# EAGLE design ThingPlus_Micromod-BottomJig (EAGLE 9.6.2)
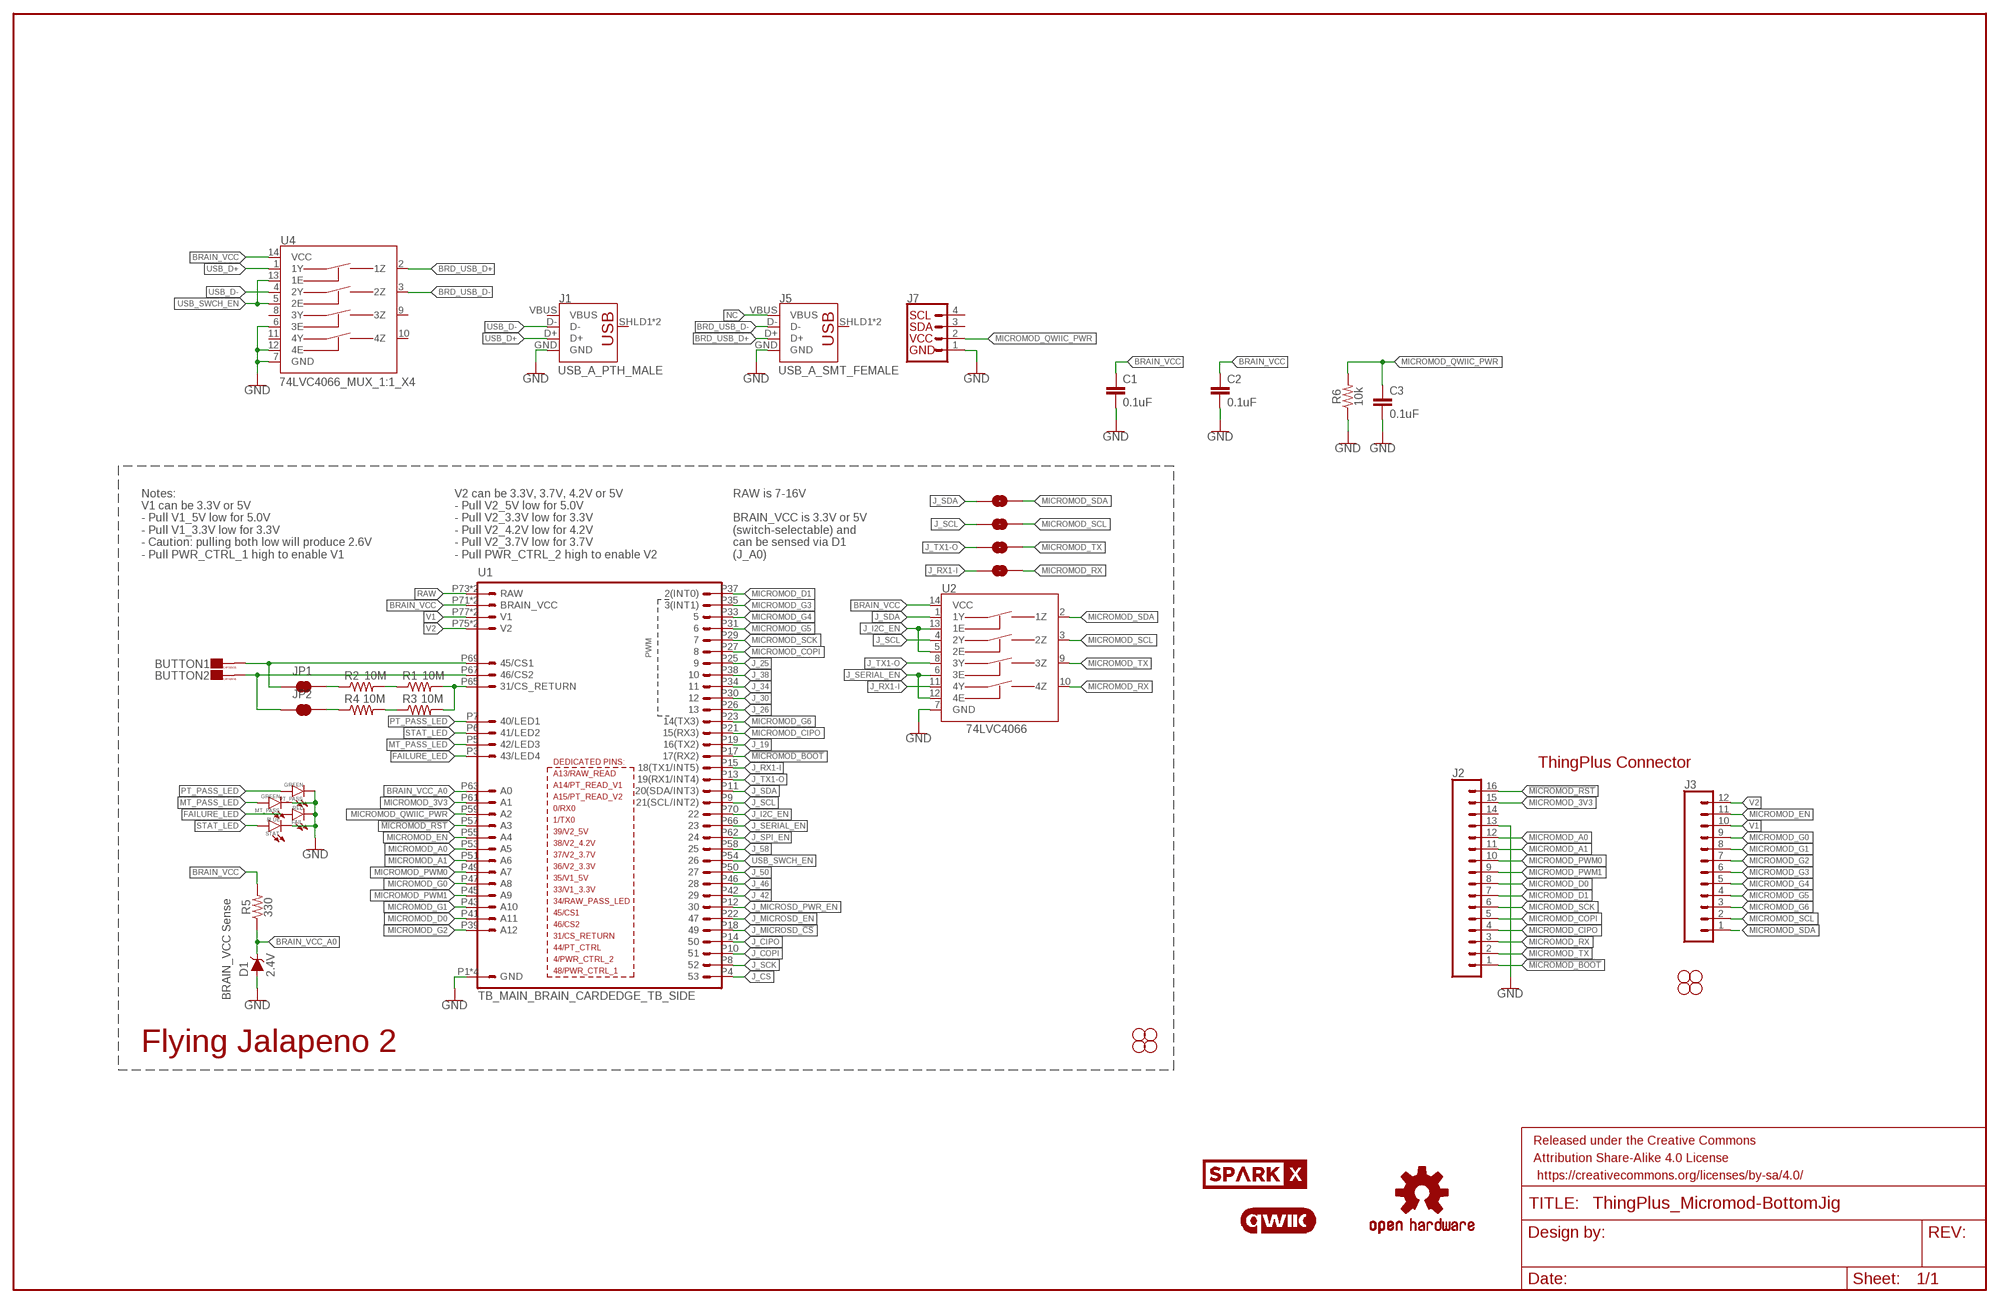
[diagram p0: schematic, sheet 1]

## Parts
BUTTON1  CAPSENSE_BUTTON_PAD_ONLYV2_SMALL  [CAPSENSE_BUTTON_PAD_ONLY_SM]
BUTTON2  CAPSENSE_BUTTON_PAD_ONLYV2_SMALL  [CAPSENSE_BUTTON_PAD_ONLY_SM]
C1  0.1uF  0.1UF-0603-25V-(+80/-20%)  [0603]
C2  0.1uF  0.1UF-0603-25V-(+80/-20%)  [0603]
C3  0.1uF  0.1UF-0603-25V-(+80/-20%)  [0603]
D1  2.4V  DIODE-ZENER-MM3Z2V4T1G  [SOD-323]
FAIL  RED  LED-RED1206  [LED-1206]
FRAME2  FRAME-LEDGER  [CREATIVE_COMMONS]
H1  STAND-OFF  [STAND-OFF]
H2  STAND-OFF  [STAND-OFF]
H3  STAND-OFF  [STAND-OFF]
H4  STAND-OFF  [STAND-OFF]
H5  STAND-OFF  [STAND-OFF]
H6  STAND-OFF  [STAND-OFF]
H7  STAND-OFF  [STAND-OFF]
H8  STAND-OFF  [STAND-OFF]
J1  USB_A_PTH_MALE  [USB-A-H]
J2  CONN_161X16_SM_SQ_NOSILK  [1X16_SM_SQ_NOSILK]
J3  CONN_12SM_SQ_NO_SILK  [1X12_SM_SQ_NOSILK]
J5  USB_A_SMT_FEMALE  [USB-A-S-SILK-FEMALE]
J7  QWIIC_RIGHT_ANGLE  QWIIC_CONNECTORJS-1MM  [JST04_1MM_RA]
J_SCL  JUMPER-SMT_2_NO_SILK  [SMT-JUMPER_2_NO_SILK]
J_SCL1  JUMPER-SMT_2_NO_SILK  [SMT-JUMPER_2_NO_SILK]
J_SCL2  JUMPER-SMT_2_NO_SILK  [SMT-JUMPER_2_NO_SILK]
J_SDA  JUMPER-SMT_2_NO_SILK  [SMT-JUMPER_2_NO_SILK]
JP1  JUMPER-SMT_2_NC_TRACE_SILK  [SMT-JUMPER_2_NC_TRACE_SILK]
JP2  JUMPER-SMT_2_NC_TRACE_SILK  [SMT-JUMPER_2_NC_TRACE_SILK]
LOGO2  OSHW-LOGOMINI  [OSHW-LOGO-MINI]
LOGO4  QWIIC_LOGO_4MM  [QWIIC_4MM]
MT_PASS  GREEN  LED-GREEN1206  [LED-1206]
PT_PASS  GREEN  LED-GREEN1206  [LED-1206]
R1  10M  10MOHM-0603-1/10W-5%  [0603]
R2  10M  10MOHM-0603-1/10W-5%  [0603]
R3  10M  10MOHM-0603-1/10W-5%  [0603]
R4  10M  10MOHM-0603-1/10W-5%  [0603]
R5  330  330OHM-0603-1/10W-1%  [0603]
R6  10k  10KOHM-0603-1/10W-1%  [0603]
STAT  BLUE  LED-BLUE1206  [LED-1206]
U1  TB_MAIN_BRAIN_CARDEDGE_TB_SIDE  [TB_CARDEDGE]
U2  74LVC4066  74LVC4066D_QUAD_BILATERAL_SWITCH  [SO14]
U4  74LVC4066_MUX_1:1_X4  [SO14]
U$1  SPARKX-LOGO4  [SPARKX-MEDIUM]

## Nets
!MICROMOD_BOOT!: J2.1 U1.P17(17(RX2))
!MICROMOD_RST!: J2.16 U1.P57(A3)
BRAIN_VCC: C1.1 C2.1 R5.2 U1.P71(BRAIN_VCC) U1.P72(BRAIN_VCC) U2.14(VCC) U4.14(VCC)
BRAIN_VCC_A0: D1.C R5.1 U1.P63(A0)
BRD_USB_D+: J5.D+ U4.2(1Z)
BRD_USB_D-: J5.D- U4.3(2Z)
FAILURE_LED: FAIL.A U1.P3(43/LED4)
GND: C1.2 C2.2 C3.2 D1.A FAIL.C J1.GND J2.13 J5.GND J7.1 MT_PASS.C PT_PASS.C R6.1 STAT.C U1.P1(GND) U1.P2(GND) U1.P79(GND) U1.P80(GND) U2.7(GND) U4.6(3E) U4.7(GND) U4.12(4E)
J_19: U1.P19(16(TX2))
J_25: U1.P25
J_26: U1.P26
J_30: U1.P30
J_34: U1.P34
J_38: U1.P38
J_42: U1.P42
J_46: U1.P46
J_50: U1.P50
J_58: U1.P58
J_CIPO: U1.P14
J_COPI: U1.P10
J_CS: U1.P4
J_I2C_EN: U1.P70 U2.5(2E) U2.13(1E)
J_MICROSD_!CS!: U1.P18
J_MICROSD_EN: U1.P22
J_MICROSD_PWR_EN: U1.P12
J_RX1-I: J_SDA.1 U1.P15(18(TX1/INT5)) U2.11(4Y)
J_SCK: U1.P8
J_SCL: J_SCL.1 U1.P9(21(SCL/INT2)) U2.4(2Y)
J_SDA: J_SCL2.1 U1.P11(20(SDA/INT3)) U2.1(1Y)
J_SERIAL_EN: U1.P66 U2.6(3E) U2.12(4E)
J_SPI_EN: U1.P62
J_TX1-O: J_SCL1.1 U1.P13(19(RX1/INT4)) U2.8(3Y)
MICROMOD_3V3: J2.15 U1.P61(A1)
MICROMOD_A0: J2.12 U1.P53(A5)
MICROMOD_A1: J2.11 U1.P51(A6)
MICROMOD_CIPO: J2.4 U1.P21(15(RX3))
MICROMOD_COPI: J2.5 U1.P27
MICROMOD_D0: J2.8 U1.P41(A11)
MICROMOD_D1: J2.7 U1.P37(2(INT0))
MICROMOD_EN: J3.11 U1.P55(A4)
MICROMOD_G0: J3.9 U1.P47(A8)
MICROMOD_G1: J3.8 U1.P43(A10)
MICROMOD_G2: J3.7 U1.P39(A12)
MICROMOD_G3: J3.6 U1.P35(3(INT1))
MICROMOD_G4: J3.5 U1.P33
MICROMOD_G5: J3.4 U1.P31
MICROMOD_G6: J3.3 U1.P23(14(TX3))
MICROMOD_PWM0: J2.10 U1.P49(A7)
MICROMOD_PWM1: J2.9 U1.P45(A9)
MICROMOD_QWIIC_PWR: C3.1 J7.2 R6.2 U1.P59(A2)
MICROMOD_RX: J2.3 J_SDA.2 U2.10(4Z)
MICROMOD_SCK: J2.6 U1.P29
MICROMOD_SCL: J3.2 J_SCL.2 U2.3(2Z)
MICROMOD_SDA: J3.1 J_SCL2.2 U2.2(1Z)
MICROMOD_TX: J2.2 J_SCL1.2 U2.9(3Z)
MT_PASS_LED: MT_PASS.A U1.P5(42/LED3)
N$1 [CAPSENSE]: R1.2 R3.2 U1.P65(31/CS_RETURN)
N$7 [CAPSENSE]: R1.1 R2.2
N$15: BUTTON1.CAPSENSE_PAD(CAPSENSE) JP1.1 U1.P69(45/CS1)
N$16 [CAPSENSE]: R3.1 R4.2
N$17 [CAPSENSE]: JP2.2 R4.1
N$18: BUTTON2.CAPSENSE_PAD(CAPSENSE) JP2.1 U1.P67(46/CS2)
N$19 [CAPSENSE]: JP1.2 R2.1
NC: J5.VBUS
PT_PASS_LED: PT_PASS.A U1.P7(40/LED1)
RAW: U1.P73(RAW) U1.P74(RAW)
STAT_LED: STAT.A U1.P6(41/LED2)
USB_D+: J1.D+ U4.1(1Y)
USB_D-: J1.D- U4.4(2Y)
USB_SWCH_EN: U1.P54 U4.5(2E) U4.13(1E)
V1 [15_mil]: J3.10 U1.P77(V1) U1.P78(V1)
V2: J3.12 U1.P75(V2) U1.P76(V2)
Unconnected: J1.SHLD1(SHIELD) J1.SHLD2(SHIELD) J2.14 J5.SHLD1(SHIELD) J5.SHLD2(SHIELD) J7.3 J7.4 U4.8(3Y) U4.9(3Z) U4.10(4Z) U4.11(4Y)

## Notes on the sheet
- Notes:
  V1 can be 3.3V or 5V
  - Pull V1_5V low for 5.0V
  - Pull V1_3.3V low for 3.3V
  - Caution: pulling both low will produce 2.6V
  - Pull PWR_CTRL_1 high to enable V1
- V2 can be 3.3V, 3.7V, 4.2V or 5V
  - Pull V2_5V low for 5.0V
  - Pull V2_3.3V low for 3.3V
  - Pull V2_4.2V low for 4.2V
  - Pull V2_3.7V low for 3.7V
  - Pull PWR_CTRL_2 high to enable V2
- RAW is 7-16V
  
  BRAIN_VCC is 3.3V or 5V
  (switch-selectable) and
  can be sensed via D1
  (J_A0)
- ThingPlus Connector
- BRAIN_VCC Sense
- Flying Jalapeno 2

## Power pins joined to a net without a drawn wire
VBUS: J1.VBUS

## Library data of the parts
BUTTON1 BUTTON2 = Testing:CAPSENSE_BUTTON_PAD_ONLY
C1-C3 = SparkFun-Capacitors:0.1UF: 0.1µF ceramic capacitors A capacitor is a passive two-terminal electrical component used to store electrical energy temporarily in an electric field.; PROD_ID: CAP-00810
D1 = New-Parts_SparkFun-DiscreteSemi:DIODE-ZENER: Zener Diode A Zener diode allows current to flow from its anode to its cathode like a normal semiconductor diode, but it also permits current to flow in the reverse direction when its "Zener voltage" is reached. - WIkipedia; DIGIKEY_PART: MM3Z2V4T1GOSCT-ND
FAIL = SparkFun-LED:LED-RED: Red SMD LED Used in manufacturing of most products at SparkFun Packages: 0603 - SMD 0603 package [Product Link] <http://docs.avagotech.com/docs/AV02-0551EN> 0603 SMART - SMD 0603 SMART package ( more efficient and expensive)[Product Link] <http://www.osram-os.com/Graphics/XPic2/00077099_0.pdf> 1206 - SMD1206 package [Product Link] <https://www.sparkfun.com/datasheets/DevTools/LilyPad/Q150OVS4.pdff> SparkFun Products: Pro Mini 328 -5V <https://www.sparkfun.com/products/821> RedBoard <https://www.sparkfun.com/products/12757> IOIO-OTG <https://www.sparkfun.com/products/13613>; PROD_ID: DIO-09912
FRAME2 = SparkFun-Aesthetics:FRAME-LEDGER: Schematic Frame - Ledger Standard 11x14 US Ledger frame
H1-H8 = SparkFun-Hardware:STAND-OFF: Stand Off Drill holes for mechanically mounting via screws, standoffs, etc. Note: Use the keepout ring to avoid running the screw head into surrounding components. Variant Overviews STAND-OFF - Mechanical footprint for a #4 phillips button head screw. STAND-OFF-TIGHT - Mechanical footprint for a #4 phillips button head screw, Example SparkFun Products Screw - Phillips Head (1/4", 4-40, 10 pack) <https://www.sparkfun.com/products/10453> (PRT-10453) Screw - Phillips Head (1/2", 4-40, 10 pack) <https://www.sparkfun.com/products/10452> (PRT-10452) Screw - Phillips Head (3/4", 4-40, 10 pack) <https://www.sparkfun.com/products/10451> (PRT-10451) Screw - Phillips Head (1", 4-40, 10 pack) <https://www.sparkfun.com/products/10450> (PRT-10450)
J1 = SparkFun-Connectors:USB_A: USB-A Connector Male and female variants, as well as PTH and SMT variants SparkFun Products: SparkFun XBee Explorer Dongle <https://www.sparkfun.com/products/11697> PTH Male SparkFun MicroView-USB Programmer <https://www.sparkfun.com/products/12924> SMT Male SparkFun USB Type A Female Breakout <https://www.sparkfun.com/products/12700> SMT Female; PROD_ID: CONN-08367; SF_ID: PRT-00437
J2 = SparkFun-Connectors:CONN_16: Multi connection point. Often used as Generic Header-pin footprint for 0.1 inch spaced/style header connections On any of the 0.1 inch spaced packages, you can populate with these: Break Away Headers - Straight <https://www.sparkfun.com/products/116> (PRT-00116) Break Away Male Headers - Right Angle <https://www.sparkfun.com/products/553> (PRT-00553) Female Headers <https://www.sparkfun.com/products/115> (PRT-00115) Break Away Headers - Machine Pin <https://www.sparkfun.com/products/117> (PRT-00117) Break Away Female Headers - Swiss Machine Pin <https://www.sparkfun.com/products/743> (PRT-00743) For SCREWTERMINALS and SPRING TERMINALS visit here: Screw Terimnals on SparkFun.com <https://www.sparkfun.com/search/results?term=Screw+Terminals> (5mm/3.5mm/2.54mm spacing) This device is also useful as a general connection point to wire up your design to another part of your project. Our various solder wires solder well into these plated through hole pads. Hook-Up Wire - Assortment (Stranded, 22 AWG) <https://www.sparkfun.com/products/11375> (PRT-11375) Hook-Up Wire - Assortment (Solid Core, 22 AWG) <https://www.sparkfun.com/products/11367> (PRT-11367) View the entire wire category on our website here <https://www.sparkfun.com/categories/141> Special notes: Molex polarized connector foot print use with SKU : PRT-08231 with associated crimp pins and housings. 1MM SMD Version SKU: PRT-10208 NOTES ON THE VARIANTS LOCK and LOCK_LONGPADS... This footprint was designed to help hold the alignment of a through-hole component (i.e. 6-pin header) while soldering it into place. You may notice that each hole has been shifted either up or down by 0.005 of an inch from it's more standard position (which is a perfectly straight line). This slight alteration caused the pins (the squares in the middle) to touch the edges of the holes. Because they are alternating, it causes a "brace" to hold the component in place. 0.005 has proven to be the perfect amount of "off-center" position when using our standard breakaway headers. Although looks a little odd when you look at the bare footprint, once you have a header in there, the alteration is very hard to notice. Also,if you push a header all the way into place, it is covered up entirely on the bottom side.
J3 = SparkFun-Connectors:CONN_12: Multi connection point. Often used as Generic Header-pin footprint for 0.1 inch spaced/style header connections On any of the 0.1 inch spaced packages, you can populate with these: Break Away Headers - Straight <https://www.sparkfun.com/products/116> (PRT-00116) Break Away Male Headers - Right Angle <https://www.sparkfun.com/products/553> (PRT-00553) Female Headers <https://www.sparkfun.com/products/115> (PRT-00115) Break Away Headers - Machine Pin <https://www.sparkfun.com/products/117> (PRT-00117) Break Away Female Headers - Swiss Machine Pin <https://www.sparkfun.com/products/743> (PRT-00743) For SCREWTERMINALS and SPRING TERMINALS visit here: Screw Terimnals on SparkFun.com <https://www.sparkfun.com/search/results?term=Screw+Terminals> (5mm/3.5mm/2.54mm spacing) This device is also useful as a general connection point to wire up your design to another part of your project. Our various solder wires solder well into these plated through hole pads. Hook-Up Wire - Assortment (Stranded, 22 AWG) <https://www.sparkfun.com/products/11375> (PRT-11375) Hook-Up Wire - Assortment (Solid Core, 22 AWG) <https://www.sparkfun.com/products/11367> (PRT-11367) View the entire wire category on our website here <https://www.sparkfun.com/categories/141> Special notes: Molex polarized connector foot print use with SKU : PRT-08231 with associated crimp pins and housings. 1MM SMD Version SKU: PRT-10208 NOTES ON THE VARIANTS LOCK and LOCK_LONGPADS... This footprint was designed to help hold the alignment of a through-hole component (i.e. 6-pin header) while soldering it into place. You may notice that each hole has been shifted either up or down by 0.005 of an inch from it's more standard position (which is a perfectly straight line). This slight alteration caused the pins (the squares in the middle) to touch the edges of the holes. Because they are alternating, it causes a "brace" to hold the component in place. 0.005 has proven to be the perfect amount of "off-center" position when using our standard breakaway headers. Although looks a little odd when you look at the bare footprint, once you have a header in there, the alteration is very hard to notice. Also,if you push a header all the way into place, it is covered up entirely on the bottom side.
J5 = SparkFun-Connectors:USB_A: USB-A Connector Male and female variants, as well as PTH and SMT variants SparkFun Products: SparkFun XBee Explorer Dongle <https://www.sparkfun.com/products/11697> PTH Male SparkFun MicroView-USB Programmer <https://www.sparkfun.com/products/12924> SMT Male SparkFun USB Type A Female Breakout <https://www.sparkfun.com/products/12700> SMT Female; PROD_ID: CONN-09520; SF_ID: PRT-09011
J7 = SparkFun-Connectors:QWIIC_CONNECTOR: SparkFun I2C Standard Qwiic Connector An SMD 1mm pitch JST connector makes it easy and quick (get it? Qwiic?) to connect I2C devices to each other. The Qwiic system <http://www.sparkfun.com/qwiic> enables fast and solderless connection between popular platforms and various sensors and actuators. We carry 200mm <https://www.sparkfun.com/products/14204>, 100mm <https://www.sparkfun.com/products/14205>, 50mm <https://www.sparkfun.com/products/14206>, and breadboard friendly <https://www.sparkfun.com/products/14207> Qwiic cables. We also offer 10 pcs strips <https://www.sparkfun.com/products/14323> the SMD connectors.; PROD_ID: CONN-13694
J_SCL J_SCL1 J_SCL2 J_SDA = SparkFun-Jumpers:JUMPER-SMT_2_NO: Normally open jumper This jumper has two pads in close proximity to each other. Apply solder to close the connection. Round pads are easier to solder for beginners, but are a lot larger. SparkFun Product that uses the round pads: SparkFun EL Sequencer <https://www.sparkfun.com/products/12781>
JP1 JP2 = SparkFun-Jumpers:JUMPER-SMT_2_NC_TRACE: Normally closed trace jumper This jumper has a trace between two pads so it's normally closed (NC). Use a razor knife to open the connection. For best results follow the IPC guidelines for cutting traces: Cutout at least 0.063 mm (0.005 in). Remove all loose material to clean up the cut area. Seal the cut with an approved epoxy. Reapply solder to reclose the connection.
LOGO2 = SparkFun-Aesthetics:OSHW-LOGO: Open-Source Hardware (OSHW) Logo This logo indicates the piece of hardware it is found on incorporates a OSHW license and/or adheres to the definition of open source hardware found here: http://freedomdefined.org/OSHW
LOGO4 = SparkFun-Aesthetics:QWIIC_LOGO: Qwiic Logos for placement on schematic and PCB. The 5.5mm silk logo is best for placing next to Qwiic connector.
MT_PASS PT_PASS = SparkFun-LED:LED-GREEN: Green SMD LED Used in manufacturing of various products at SparkFun Packages: 0603 - SMD 0603 package [Product Link] <http://www.futureelectronics.com/en/technologies/semiconductors/optoelectronics/leds/Pages/9894312-LTST-C190GKT.aspx?CrossPart=HSMG-C190&IM=0> LilyPad 1206 - SMD1206 LilyPad package [Product Link] <http://www.futureelectronics.com/en/Technologies/Product.aspx?ProductID=IN150NGHARVATEKCORPORATION2049943&IM=0> 1206 - SMD1206 package [Product Link] <http://www.futureelectronics.com/en/technologies/semiconductors/optoelectronics/leds/Pages/8315665-LTST-C150KGKT.aspx?IM=0> 1206 Bottom Mount -SMD 1206 Bottom Mount [Product Link] <http://www.digikey.com/product-detail/en/lite-on-inc/LTST-C230KGKT/160-1456-1-ND/386854> SparkFun Products: Pro Mini 328 -5V <https://www.sparkfun.com/products/821> RedBoard <https://www.sparkfun.com/products/12757> MP3 Trigger <https://www.sparkfun.com/products/13720> Makey Makey <https://www.sparkfun.com/products/11076>; PROD_ID: DIO-00862
R1-R4 = SparkFun-Resistors:10MOHM: RES-09327; PROD_ID: RES-08283
R5 = SparkFun-Resistors:330OHM: 330Ω resistor A resistor is a passive two-terminal electrical component that implements electrical resistance as a circuit element. Resistors act to reduce current flow, and, at the same time, act to lower voltage levels within circuits. - Wikipedia; PROD_ID: RES-00818
R6 = SparkFun-Resistors:10KOHM: 10kΩ resistor A resistor is a passive two-terminal electrical component that implements electrical resistance as a circuit element. Resistors act to reduce current flow, and, at the same time, act to lower voltage levels within circuits. - Wikipedia; PROD_ID: RES-00824
STAT = SparkFun-LED:LED-BLUE: Blue SMD LED Used in manufacturing of various products at SparkFun Packages: 0603 - SMD 0603 package [Product Link] <http://www.digikey.com/product-detail/en/SMLE12BC7TT86/511-1589-2-ND/1641808> 1206 - SMD1206 package [Product Link] <http://www.digikey.com/product-detail/en/lite-on-inc/LTST-C150TBKT/160-1643-1-ND/573584> SparkFun Products: ESP8266 Thing-Dev Board <https://www.sparkfun.com/products/13711> RedBoard <https://www.sparkfun.com/products/12757>; PROD_ID: DIO-09911
U1 = Testing:TB_MAIN_BRAIN_CARDEDGE
U2 = SparkFun-IC-Logic:74LVC4066D_QUAD_BILATERAL_SWITCH: Nexperia Quad Bilateral Switch The 74LVC4066 is a high-speed Si-gate CMOS device. The 74LVC4066 provides four single pole, single-throw analog switch functions. Each switch has two input/output terminals (nY and nZ) and an active HIGH enable input (nE). When nE is LOW, the analog switch is turned off. Schmitt-trigger action at the enable inputs makes the circuit tolerant of slower input rise and fall times across the entire VCC range from 1.65 V to 5.5 V. Datasheet <https://assets.nexperia.com/documents/data-sheet/74LVC4066.pdf>; PROD_ID: IC-13944
U4 = Testing:74LVC4066_MUX_1:1_X4
U$1 = SparkX:SPARKX-LOGO

## Net classes
1 power: width 0.457 mm
2 12 mil: width 0.305 mm
3 CAPSENSE: width 0.508 mm
4 15_mil: width 0.381 mm

## Board
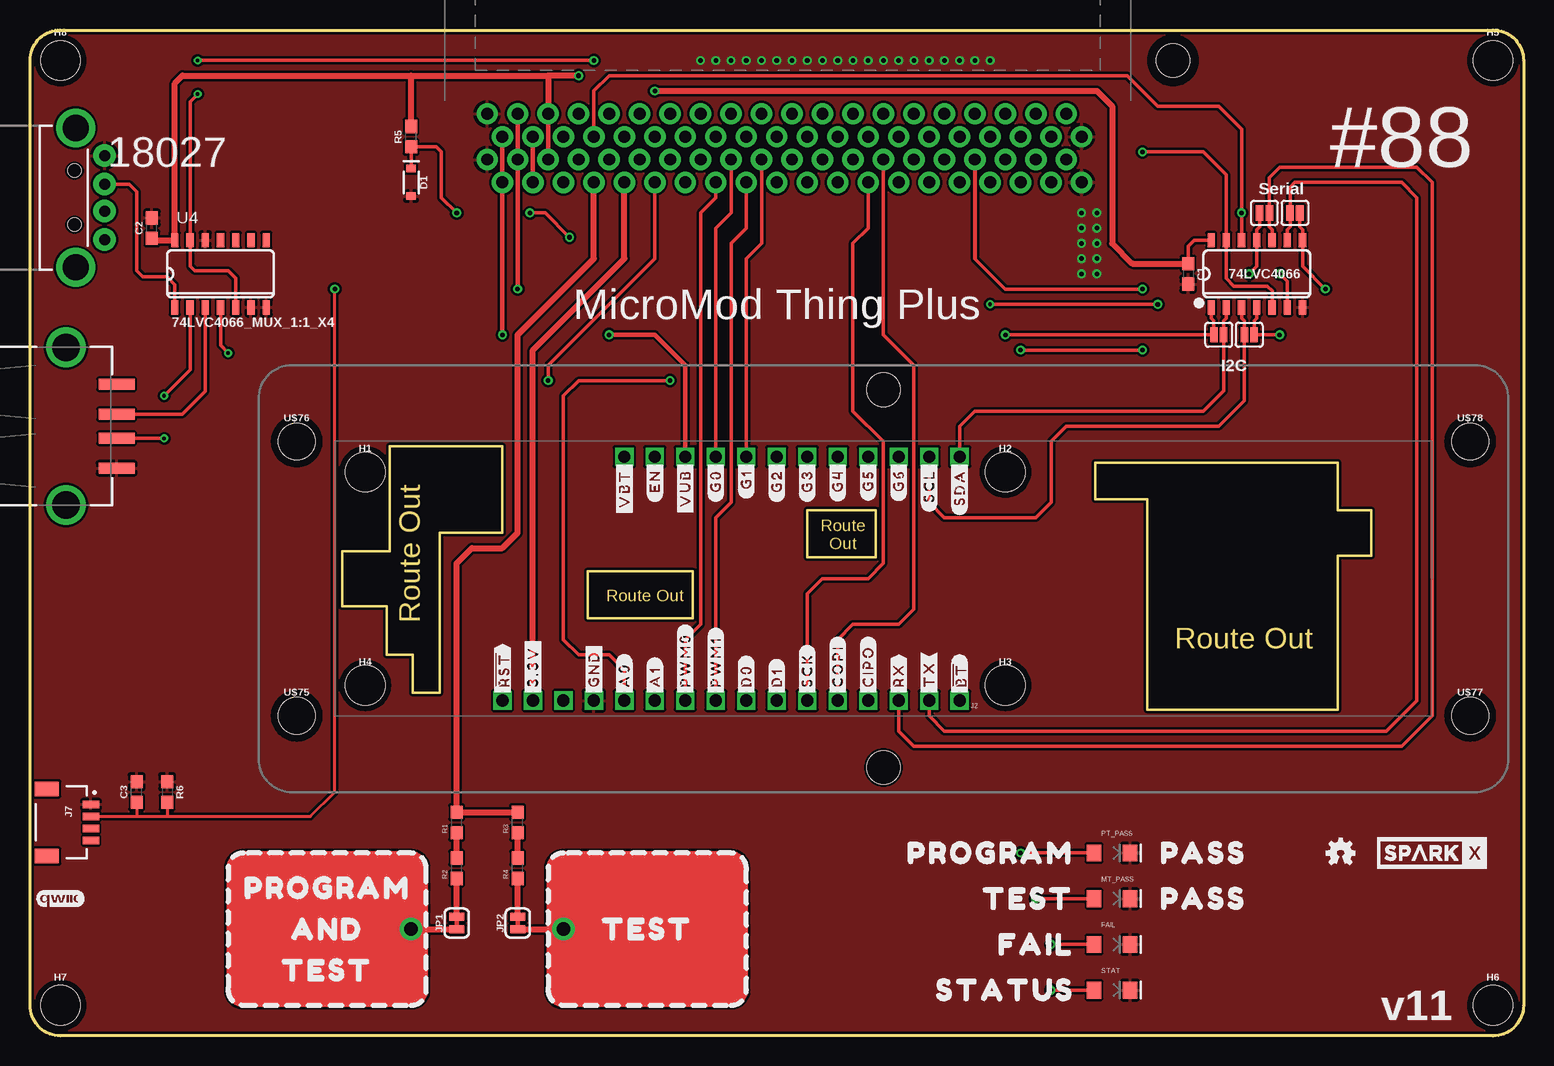
[diagram p1: board, top side]
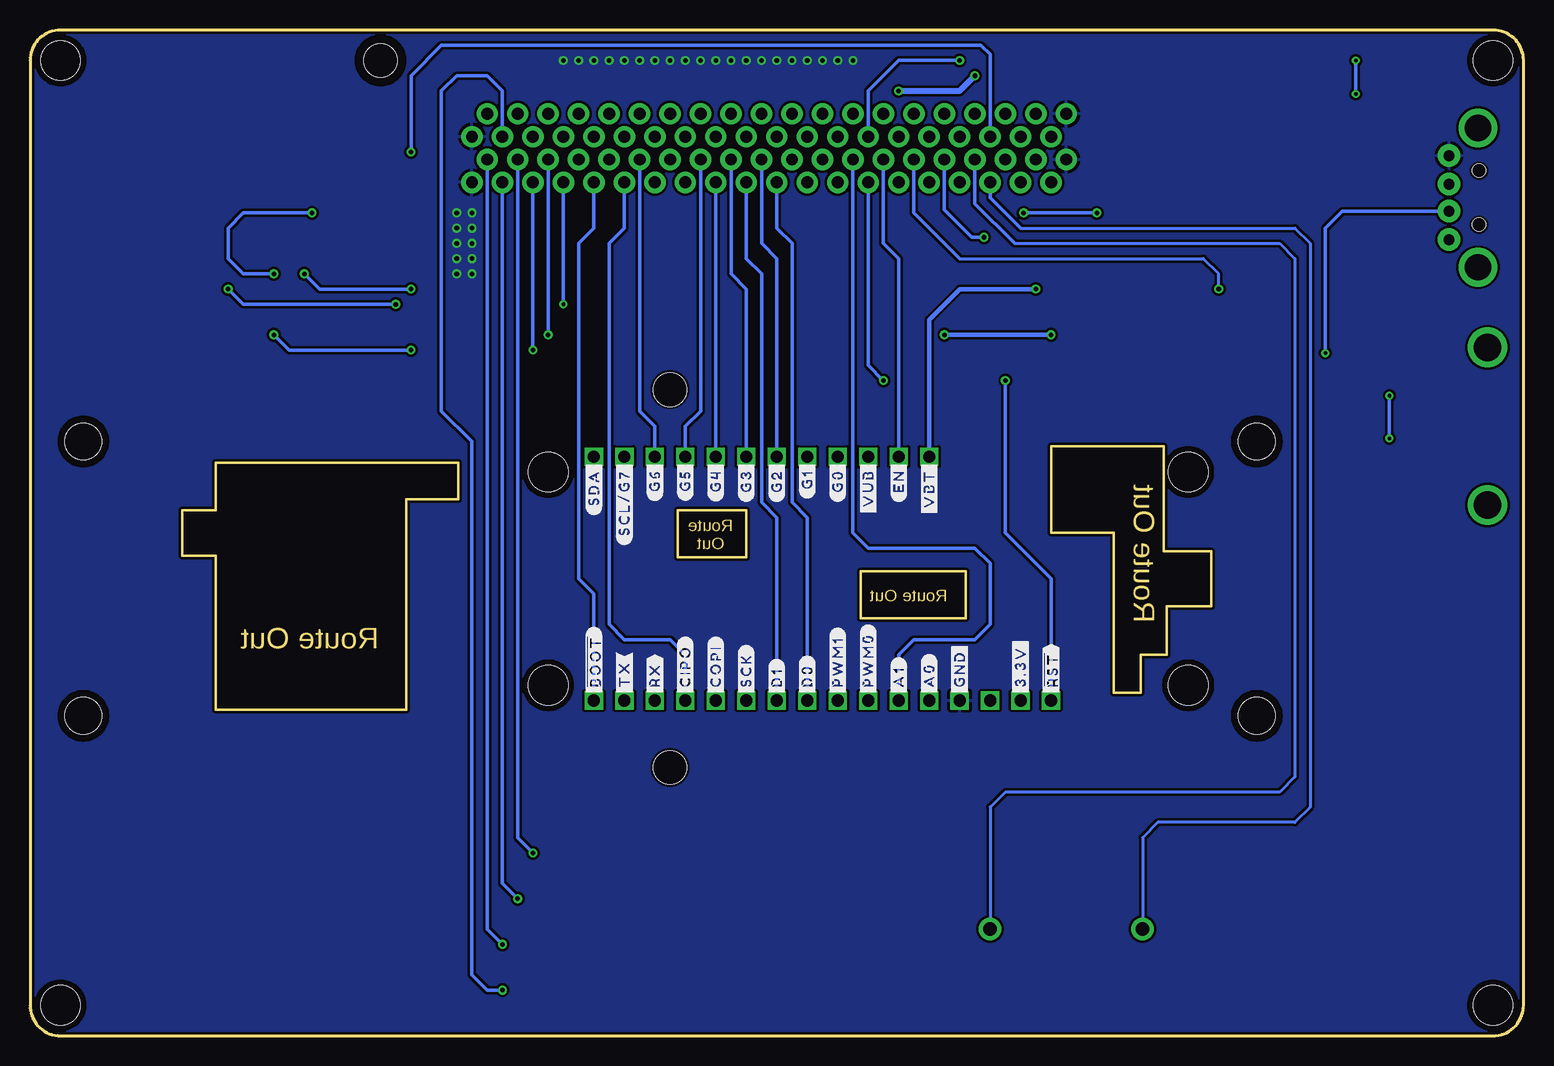
[diagram p2: board, bottom side, seen from below]

Size 124.46 x 83.82 mm. Coordinates in mm from the lower left corner, seen from the top.
Outline: 2.54,83.82 121.92,83.82 arc-90 124.46,81.28 124.46,2.54 arc-90 121.92,0 2.54,0 arc-90 0,2.54 0,81.28 arc-90 2.54,83.82
Outline: 31.88,28.57 34.16,28.57 34.16,41.91 39.37,41.91 39.37,49.15 29.97,49.15 29.97,40.39 26.03,40.39 26.03,35.81 29.72,35.81 29.72,31.75 31.88,31.75 31.88,28.57
Outline: 46.48,38.73 55.25,38.73 55.25,34.8 46.48,34.8 46.48,38.73
Outline: 64.77,43.81 70.48,43.81 70.48,39.88 64.77,39.88 64.77,43.81
Outline: 88.77,47.75 108.97,47.75 108.97,43.81 111.76,43.81 111.76,40 108.97,40 108.97,27.18 93.09,27.18 93.09,44.7 88.77,44.7 88.77,47.75
Copper layers (1*16): Top 0.035mm / dielectric 1.5mm / Bottom 0.035mm
Design rules "SparkFun-2-Layer-General-JLCPCB": minimum track width 7mil, minimum drill 0.3mm, track to track 7mil, track to pad 7mil, pad to pad 7mil, via to via 7mil, smd to smd 7mil, copper to edge 7mil, drill to drill 7mil, minimum pad ring 7mil, minimum via ring 7mil, stop-mask expansion 4mil, vias tented up to drill 25mil, thermal gap 10mil
Milling: area 26,28.6 to 39.4,49.1; area 46.5,34.8 to 55.2,38.7; area 64.8,39.9 to 70.5,43.8; area 88.8,27.2 to 111.8,47.8

### Footprints (pad centres in the part's own frame; a part is rotated, then mirrored left to right if it is on the bottom)
CAPSENSE_BUTTON_PAD_ONLY_SM = drill 1.118 pad 1.88: CAPSENSE_PAD 0,6.35
0603 = smd 1.1 x 1: 1 -0.85,0; 2 0.85,0
SOD-323 = smd 0.63 x 0.83: A 1.15,0; C -1.15,0
LED-1206 = smd 1.2 x 1.4: A -1.5,0; C 1.5,0
STAND-OFF = hole 3.302: 0,0
USB-A-H = drill 0.914 pad 1.88: D+ 2.4,1.127; D- 2.4,-1.127; GND 2.4,3.5; VBUS 2.4,-3.5 | drill 2.2: SHLD1 0,-5.8; SHLD2 0,5.8 | hole 1.1: -0.1,2.25; -0.1,-2.25
1X16_SM_SQ_NOSILK = drill 1.016 pad 1.27 square: 1 0,0; 2 2.54,0; 3 5.08,0; 4 7.62,0; 5 10.16,0; 6 12.7,0; 7 15.24,0; 8 17.78,0; 9 20.32,0; 10 22.86,0; 11 25.4,0; 12 27.94,0; 13 30.48,0; 14 33.02,0; 15 35.56,0; 16 38.1,0
1X12_SM_SQ_NOSILK = drill 1.016 pad 1.27 square: 1 0,0; 2 2.54,0; 3 5.08,0; 4 7.62,0; 5 10.16,0; 6 12.7,0; 7 15.24,0; 8 17.78,0; 9 20.32,0; 10 22.86,0; 11 25.4,0; 12 27.94,0
USB-A-S-SILK-FEMALE = smd 3 x 0.9: D+ 7.212,-1; D- 7.212,1; GND 7.212,-3.5; VBUS 7.212,3.5 | drill 2.311: SHLD1 3,-6.566; SHLD2 3,6.566
JST04_1MM_RA = smd 0.6 x 1.35: 1 -1.5,0; 2 -0.5,0; 3 0.5,0; 4 1.5,0 | smd 1.2 x 2: NC1 2.8,-3.675; NC2 -2.8,-3.675
SMT-JUMPER_2_NO_SILK = smd 0.635 x 1.27: 1 -0.406,0; 2 0.406,0
SMT-JUMPER_2_NC_TRACE_SILK = smd 0.66 x 1.27: 1 -0.521,0; 2 0.521,0
TB_CARDEDGE = drill 0.991 pad 1.778: P1 24.13,-7.62; P2 24.13,-3.81; P3 22.86,-5.715; P4 22.86,-1.905; P5 21.59,-7.62; P6 21.59,-3.81; P7 20.32,-5.715; P8 20.32,-1.905; P9 19.05,-7.62; P10 19.05,-3.81; P11 17.78,-5.715; P12 17.78,-1.905; P13 16.51,-7.62; P14 16.51,-3.81; P15 15.24,-5.715; P16 15.24,-1.905; P17 13.97,-7.62; P18 13.97,-3.81; P19 12.7,-5.715; P20 12.7,-1.905; P21 11.43,-7.62; P22 11.43,-3.81; P23 10.16,-5.715; P24 10.16,-1.905; P25 8.89,-7.62; P26 8.89,-3.81; P27 7.62,-5.715; P28 7.62,-1.905; P29 6.35,-7.62; P30 6.35,-3.81; P31 5.08,-5.715; P32 5.08,-1.905; P33 3.81,-7.62; P34 3.81,-3.81; P35 2.54,-5.715; P36 2.54,-1.905; P37 1.27,-7.62; P38 1.27,-3.81; P39 0,-5.715; P40 0,-1.905; P41 -1.27,-7.62; P42 -1.27,-3.81; P43 -2.54,-5.715; P44 -2.54,-1.905; P45 -3.81,-7.62; P46 -3.81,-3.81; P47 -5.08,-5.715; P48 -5.08,-1.905; P49 -6.35,-7.62; P50 -6.35,-3.81; P51 -7.62,-5.715; P52 -7.62,-1.905; P53 -8.89,-7.62; P54 -8.89,-3.81; P55 -10.16,-5.715; P56 -10.16,-1.905; P57 -11.43,-7.62; P58 -11.43,-3.81; P59 -12.7,-5.715; P60 -12.7,-1.905; P61 -13.97,-7.62; P62 -13.97,-3.81; P63 -15.24,-5.715; P64 -15.24,-1.905; P65 -16.51,-7.62; P66 -16.51,-3.81; P67 -17.78,-5.715; P68 -17.78,-1.905; P69 -19.05,-7.62; P70 -19.05,-3.81; P71 -20.32,-5.715; P72 -20.32,-1.905; P73 -21.59,-7.62; P74 -21.59,-3.81; P75 -22.86,-5.715; P76 -22.86,-1.905; P77 -24.13,-7.62; P78 -24.13,-3.81; P79 -25.4,-5.715; P80 -25.4,-1.905 | hole 2.794: 31.75,2.54
SO14 = smd 0.6 x 1.2: 1 -3.175,-2.8; 2 -1.905,-2.8; 3 -0.635,-2.8; 4 0.635,-2.8; 5 1.905,-2.8; 6 3.175,-2.8; 7 4.445,-2.8; 8 4.445,2.8; 9 3.175,2.8; 10 1.905,2.8; 11 0.635,2.8; 12 -0.635,2.8; 13 -1.905,2.8; 14 -3.175,2.8
STAND-OFF-TIGHT = hole 3.048: 0,0
NUBBIN_LOCKER = hole 2.794: 0,0

### Placement (x,y rotation side)
BUTTON1  25.4,8.89 270 top
BUTTON2  50.8,8.89 90 top
C1  96.52,63.5 270 top
C2  10.16,67.31 90 top
C3  8.89,20.32 90 top
D1  31.75,71.12 270 top
FAIL  90.17,7.62 0 top
FRAME2  44.45,-15.24 0 top  (outside the outline)
H1  27.94,46.99 0 top
H2  81.28,46.99 0 top
H3  81.28,29.21 0 top
H4  27.94,29.21 0 top
H5  121.92,81.28 0 top
H6  121.92,2.54 0 top
H7  2.54,2.54 0 top
H8  2.54,81.28 0 top
J1  3.81,69.85 0 top
J2  77.47,27.94 180 top
J3  77.47,48.26 180 top
J5  0,50.8 0 top
J7  5.08,17.78 270 top
J_SCL  101.6,58.42 180 top
J_SCL1  105.41,68.58 180 top
J_SCL2  99.06,58.42 0 top
J_SDA  102.87,68.58 0 top
JP1  35.56,9.4 90 top
JP2  40.64,9.4 90 top
LOGO2  109.22,15.24 0 top
LOGO4  2.54,11.43 0 top
MT_PASS  90.17,11.43 0 top
PT_PASS  90.17,15.24 0 top
R1  35.56,17.78 90 top
R2  35.56,13.97 90 top
R3  40.64,17.78 90 top
R4  40.64,13.97 90 top
R5  31.75,74.93 90 top
R6  11.43,20.32 270 top
STAT  90.17,3.81 0 top
U1  63.5,78.74 0 top
U2  101.6,63.5 0 top
U4  15.24,63.5 0 top
U$1  116.84,15.24 0 top
U$3  [##BT##11]  77.47,28.32 90 top
U$4  [#TX#9]  74.93,28.32 90 top
U$5  [#RX#8]  72.39,28.32 90 top
U$6  [#CIPO#7]  69.85,28.32 90 top
U$7  [#COPI#6]  67.31,28.32 90 top
U$8  [#SCK#5]  64.77,28.32 90 top
U$9  [#D1#5]  62.23,28.32 90 top
U$10  [#D0#5]  59.69,28.32 90 top
U$11  [#PWM0#5]  54.61,28.32 90 top
U$12  [#PWM1#5]  57.15,28.32 90 top
U$13  [#A1#5]  52.07,28.32 90 top
U$14  [#A0#5]  49.53,28.32 90 top
U$15  [#GND#4]  46.99,28.32 90 top
U$16  [#3#3V#1]  41.91,28.32 90 top
U$17  [##RST##0]  39.37,28.32 90 top
U$22  [#VBT#16]  49.53,47.88 90 top
U$23  [#EN#15]  52.07,47.88 90 top
U$24  [#G0#14]  57.15,47.88 90 top
U$25  [#G1#14]  59.69,47.88 90 top
U$26  [#G2#14]  62.23,47.88 90 top
U$27  [#G3#14]  64.77,47.88 90 top
U$28  [#G4#14]  67.31,47.88 90 top
U$29  [#G5#14]  69.85,47.88 90 top
U$30  [#G6#14]  72.39,47.88 90 top
U$31  [#SCL#13]  74.93,47.88 90 top
U$32  [#SDA#12]  77.47,47.88 90 top
U$35  [#VUB#15]  54.61,47.88 90 top
U$42  [#TX#9]  74.93,28.32 90 bottom
U$43  [#RX#8]  72.39,28.32 90 bottom
U$44  [#CIPO#7]  69.85,28.32 90 bottom
U$45  [#COPI#6]  67.31,28.32 90 bottom
U$46  [#SCK#5]  64.77,28.32 90 bottom
U$47  [#D1#5]  62.23,28.32 90 bottom
U$48  [#D0#5]  59.69,28.32 90 bottom
U$49  [#PWM0#5]  54.61,28.32 90 bottom
U$50  [#PWM1#5]  57.15,28.32 90 bottom
U$51  [#A1#5]  52.07,28.32 90 bottom
U$52  [#A0#5]  49.53,28.32 90 bottom
U$53  [#GND#4]  46.99,28.32 90 bottom
U$54  [#3#3V#1]  41.91,28.32 90 bottom
U$55  [##RST##0]  39.37,28.32 90 bottom
U$56  [##BOOT##10]  77.47,28.32 90 bottom
U$57  [#VBT#16]  49.53,47.88 90 bottom
U$58  [#EN#15]  52.07,47.88 90 bottom
U$59  [#G0#14]  57.15,47.88 90 bottom
U$60  [#G1#14]  59.69,47.88 90 bottom
U$61  [#G2#14]  62.23,47.88 90 bottom
U$62  [#G3#14]  64.77,47.88 90 bottom
U$63  [#G4#14]  67.31,47.88 90 bottom
U$64  [#G5#14]  69.85,47.88 90 bottom
U$65  [#G6#14]  72.39,47.88 90 bottom
U$67  [#SDA#12]  77.47,47.88 90 bottom
U$68  [#VUB#15]  54.61,47.88 90 bottom
U$71  [#SCL#G7#14]  74.93,47.88 90 bottom
U$75  [STAND-OFF-TIGHT]  22.22,26.67 0 top
U$76  [STAND-OFF-TIGHT]  22.22,49.53 0 top
U$77  [STAND-OFF-TIGHT]  120.02,26.67 0 top
U$78  [STAND-OFF-TIGHT]  120.02,49.53 0 top
U$79  [NUBBIN_LOCKER]  71.12,22.35 0 top
U$80  [NUBBIN_LOCKER]  71.12,53.85 0 top
U$82  [PROGRAM0]  24.77,12.32 0 top
U$83  [PROGRAM0]  80.01,15.24 0 top
U$84  [AND0]  24.77,8.89 0 top
U$85  [TEST0]  24.77,5.46 0 top
U$86  [TEST0]  51.44,8.89 0 top
U$87  [TEST0]  83.19,11.43 0 top
U$88  [PASS0]  97.79,15.24 0 top
U$89  [PASS0]  97.79,11.43 0 top
U$90  [FAIL0]  83.82,7.62 0 top
U$91  [STATUS0]  81.28,3.81 0 top

### Tracks (layer width: path | path; a pad name or v marks a point on that pad's centre or on a via)
!MICROMOD_BOOT!
  Bottom 0.305: J2.1 77.47,36.83 78.74,38.1 78.74,66.04 77.47,67.31 U1.P17
!MICROMOD_RST!  (via drill 0.38)
  Top 0.305: v43.18,54.61 43.18,55.88 52.07,64.77 U1.P57
  Bottom 0.305: J2.16 39.37,38.1 43.18,41.91 v43.18,54.61
BRAIN_VCC  (via drill 0.38)
  Top 0.305: C1.1 96.52,65.79 97.03,66.3 U2.14
  Top 0.381: U1.P72 U1.P71
  Top 0.508: R5.2 31.75,80.01 | v52.07,78.74 88.9,78.74 90.17,77.47 90.17,66.04 91.86,64.35 C1.1 | 31.75,80.01 43.18,80.01 | 43.18,80.01 U1.P72 | v45.72,80.01 43.18,80.01 | C2.1 10.32,66.3 U4.14 12.06,79.38 12.7,80.01 31.75,80.01
  Bottom 0.508: v52.07,78.74 46.99,78.74 v45.72,80.01
BRAIN_VCC_A0  (via drill 0.38)
  Top 0.305: D1.C R5.1 33.87,74.08 34.29,73.66 34.29,69.85 v35.56,68.58 | v41.66,68.58 42.93,68.58 v44.96,66.55
  Bottom 0.305: v35.56,68.58 v41.66,68.58 | v44.96,66.55 45.97,66.55 48.26,68.83 U1.P63
BRD_USB_D+  (via drill 0.3)
  Top 0.305: J5.D+ 11.16,49.8 v11.18,49.78 | v11.18,53.34 13.34,55.5 U4.2
  Bottom 0.305: v11.18,49.78 v11.18,53.34
BRD_USB_D-
  Top 0.305: J5.D- 12.68,51.8 14.61,53.72 U4.3
FAILURE_LED  (via drill 0.38)
  Top 0.305: v85.09,7.62 FAIL.A
  Bottom 0.305: U1.P3 86.36,8.89 v85.09,7.62
GND  (via drill 0.38)
  other vias: 87.63,68.58 88.9,68.58 87.63,67.31 88.9,67.31 87.63,66.04 88.9,66.04 88.9,64.77 87.63,64.77 87.63,63.5 88.9,63.5 80.01,81.28 78.74,81.28 77.47,81.28 76.2,81.28 74.93,81.28 73.66,81.28 72.39,81.28 55.88,81.28 57.15,81.28 58.42,81.28 59.69,81.28 60.96,81.28 62.23,81.28 63.5,81.28 64.77,81.28 66.04,81.28 67.31,81.28 68.58,81.28 69.85,81.28 71.12,81.28
  pour Top (isolate 0.203): 0,83.82 124.46,83.82 124.46,0 0,0
  pour Bottom (isolate 0.203): 0,83.82 124.46,83.82 124.46,0 0,0
J_I2C_EN  (via drill 0.38)
  Top 0.305: v92.71,73.66 97.79,73.66 99.69,71.76 U2.13 99.69,63.12 100.33,62.48 103.12,62.48 103.5,62.1 U2.5
  Bottom 0.305: U1.P70 44.45,81.79 45.21,82.55 90.17,82.55 92.71,80.01 v92.71,73.66
J_RX1-I  (via drill 0.38)
  Top 0.305: J_SDA.1 102.46,67.41 102.23,67.18 U2.11 102.23,64.14 v101.6,63.5 | v92.71,62.23 81.28,62.23 78.74,64.77
  Top 0.33: U1.P15 78.74,64.77
  Bottom 0.305: v92.71,62.23 100.33,62.23 v101.6,63.5
J_SCL  (via drill 0.38)
  Top 0.305: U2.4 102.23,59.82 102.01,59.59 J_SCL.1 v104.14,58.42 | v82.55,57.15 v92.71,57.15
  Bottom 0.305: U1.P9 v82.55,57.15 | v92.71,57.15 102.87,57.15 v104.14,58.42
J_SDA  (via drill 0.38)
  Top 0.305: U2.1 98.42,59.82 98.65,59.59 J_SCL2.1 v81.28,58.42
  Bottom 0.305: U1.P11 v81.28,58.42
J_SERIAL_EN  (via drill 0.38)
  Top 0.305: U1.P66 46.99,78.74 48.26,80.01 91.44,80.01 93.98,77.47 99.06,77.47 100.97,75.57 v100.97,68.58 U2.12 | U2.6 104.78,62.87 v104.14,63.5
  Bottom 0.305: v104.14,63.5 106.68,63.5 107.95,64.77 107.95,67.31 106.68,68.58 v100.97,68.58
J_TX1-O  (via drill 0.3, 0.38)
  Top 0.305: J_SCL1.1 105.82,67.41 106.05,67.18 U2.8 106.05,64.14 v107.95,62.23 | v80.01,60.96 v93.98,60.96
  Bottom 0.305: v93.98,60.96 106.68,60.96 v107.95,62.23 | U1.P13 v80.01,60.96
MICROMOD_3V3
  Top 0.508: J2.15 41.91,57.15 49.53,64.77 U1.P61
MICROMOD_A0  (via drill 0.38)
  Top 0.305: J2.12 49.53,30.48 48.26,31.75 45.72,31.75 44.45,33.02 44.45,53.34 45.72,54.61 v53.34,54.61
  Bottom 0.305: v53.34,54.61 54.61,55.88 U1.P53
MICROMOD_A1
  Bottom 0.305: J2.11 52.07,31.75 50.8,33.02 45.72,33.02 44.45,34.29 44.45,39.37 45.72,40.64 54.61,40.64 55.88,41.91 U1.P51
MICROMOD_CIPO
  Bottom 0.305: J2.4 69.85,31.75 71.12,33.02 74.93,33.02 76.2,34.29 76.2,66.04 74.93,67.31 U1.P21
MICROMOD_COPI
  Top 0.305: J2.5 67.31,33.02 68.58,34.29 72.39,34.29 73.66,35.56 73.66,55.88 71.12,58.42 U1.P27
MICROMOD_D0
  Bottom 0.305: J2.8 59.69,43.18 60.96,44.45 60.96,66.04 62.23,67.31 U1.P41
MICROMOD_D1
  Bottom 0.305: J2.7 62.23,43.18 63.5,44.45 63.5,63.5 64.77,64.77 U1.P37
MICROMOD_EN
  Bottom 0.305: J3.11 52.07,64.77 53.34,66.04 U1.P55
MICROMOD_G0
  Top 0.305: J3.9 57.15,67.31 58.42,68.58 U1.P47
MICROMOD_G1
  Top 0.305: J3.8 59.69,64.77 60.96,66.04 U1.P43
MICROMOD_G2
  Bottom 0.305: J3.7 62.23,64.77 63.5,66.04 U1.P39
MICROMOD_G3
  Bottom 0.305: J3.6 64.77,62.23 66.04,63.5 U1.P35
MICROMOD_G4
  Bottom 0.305: J3.5 U1.P33
MICROMOD_G5
  Bottom 0.305: J3.4 69.85,50.8 68.58,52.07 U1.P31
MICROMOD_G6
  Bottom 0.305: J3.3 72.39,50.8 73.66,52.07 U1.P23
MICROMOD_PWM0
  Top 0.305: J2.10 54.61,33.02 55.88,34.29 55.88,68.58 57.15,69.85 U1.P49
MICROMOD_PWM1
  Top 0.305: J2.9 57.15,43.18 58.42,44.45 58.42,66.04 59.69,67.31 U1.P45
MICROMOD_QWIIC_PWR  (via drill 0.38)
  Top 0.254: J7.2 8.89,18.28 | 8.89,18.28 11.43,18.28 | 11.43,18.28 23.36,18.28 25.4,20.32 v25.4,62.23 | C3.1 8.89,18.28 | R6.2 11.43,18.28
  Bottom 0.254: 46.99,64.77 26.67,64.77 25.4,63.5 v25.4,62.23
  Bottom 0.305: U1.P59 50.8,68.58 46.99,64.77
MICROMOD_RX
  Top 0.305: U2.10 103.5,67.18 103.28,67.41 J_SDA.2 103.28,71.53 104.14,72.39 115.57,72.39 116.84,71.12 116.84,26.67 114.3,24.13 73.66,24.13 72.39,25.4 J2.3
MICROMOD_SCK
  Top 0.305: J2.6 64.77,36.83 66.04,38.1 69.85,38.1 71.12,39.37 71.12,49.53 68.58,52.07 68.58,66.04 69.85,67.31 U1.P29
MICROMOD_SCL
  Top 0.305: U2.3 100.97,59.82 101.19,59.59 J_SCL.2 101.19,52.93 99.06,50.8 86.36,50.8 85.09,49.53 85.09,44.45 83.82,43.18 76.2,43.18 74.93,44.45 J3.2
MICROMOD_SDA
  Top 0.305: U2.2 99.69,59.82 99.47,59.59 J_SCL2.2 99.47,53.75 97.79,52.07 78.74,52.07 77.47,50.8 J3.1
MICROMOD_TX
  Top 0.305: U2.9 104.78,67.18 105,67.41 J_SCL1.2 105,70.71 105.41,71.12 114.3,71.12 115.57,69.85 115.57,27.94 113.03,25.4 76.2,25.4 74.93,26.67 J2.2
MT_PASS_LED  (via drill 0.38)
  Top 0.305: v83.82,11.43 MT_PASS.A
  Bottom 0.305: U1.P5 85.09,12.7 v83.82,11.43
N$1
  Top 0.508: R3.2 R1.2 35.56,39.37 36.83,40.64 39.37,40.64 40.64,41.91 40.64,58.42 46.99,64.77 U1.P65
N$7
  Top 0.508: R2.2 R1.1
N$15
  Top 0.508: BUTTON1.CAPSENSE_PAD 35.55,8.89 JP1.1
  Bottom 0.254: 41.91,67.31 19.05,67.31 17.78,66.04 17.78,19.05 19.05,17.78 30.48,17.78 31.75,16.51 BUTTON1.CAPSENSE_PAD
  Bottom 0.305: 41.91,67.31 44.45,69.85 U1.P69
N$16
  Top 0.508: R4.2 R3.1
N$17
  Top 0.508: JP2.2 R4.1
N$18
  Top 0.508: JP2.1 40.65,8.89 BUTTON2.CAPSENSE_PAD
  Bottom 0.254: 42.42,66.04 20.32,66.04 19.05,64.77 19.05,21.59 20.32,20.32 43.18,20.32 44.45,19.05 BUTTON2.CAPSENSE_PAD
  Bottom 0.305: 42.42,66.04 45.72,69.34 U1.P67
N$19
  Top 0.508: JP1.2 R2.1
PT_PASS_LED  (via drill 0.38)
  Top 0.305: v82.55,15.24 PT_PASS.A
  Bottom 0.305: U1.P7 83.82,16.51 v82.55,15.24
RAW
  Top 0.381: U1.P74 U1.P73
STAT_LED  (via drill 0.38)
  Top 0.305: v85.09,3.81 STAT.A
  Bottom 0.305: U1.P6 85.09,78.74 86.36,80.01 88.9,80.01 90.17,78.74 90.17,52.07 87.63,49.53 87.63,5.08 86.36,3.81 v85.09,3.81
USB_D+
  Top 0.305: U4.1 12.06,62.61 11.43,63.25 9.4,63.25 8.89,63.75 8.89,70.36 8.27,70.98 J1.D+
USB_D-  (via drill 0.3)
  Top 0.305: v16.51,56.9 15.88,57.53 U4.4
  Bottom 0.305: J1.D- 15.1,68.72 16.51,67.31 v16.51,56.9
USB_SWCH_EN  (via drill 0.3, 0.38)
  Top 0.305: U4.5 17.14,63.12 16.51,63.75 13.72,63.75 13.34,64.14 U4.13 13.34,77.85 v13.97,78.49 | v13.97,81.28 v46.99,81.28
  Bottom 0.305: v46.99,81.28 52.07,81.28 54.61,78.74 U1.P54 | v13.97,78.49 v13.97,81.28
V1  (via drill 0.38)
  Top 0.381: U1.P78 U1.P77 v39.37,58.42 | v48.26,58.42 52.07,58.42 54.61,55.88 J3.10
  Bottom 0.381: v39.37,58.42 v48.26,58.42
V2  (via drill 0.38)
  Top 0.381: U1.P76 U1.P75 v40.64,62.23
  Bottom 0.381: v40.64,62.23 46.99,62.23 49.53,59.69 J3.12

### Text on the board
Dimension: Route / Out | Route Out | Route Out | Route Out
tPlace: #88 | 18027 | Serial | MicroMod Thing Plus | I2C | v11
tDocu: Ricardo R.